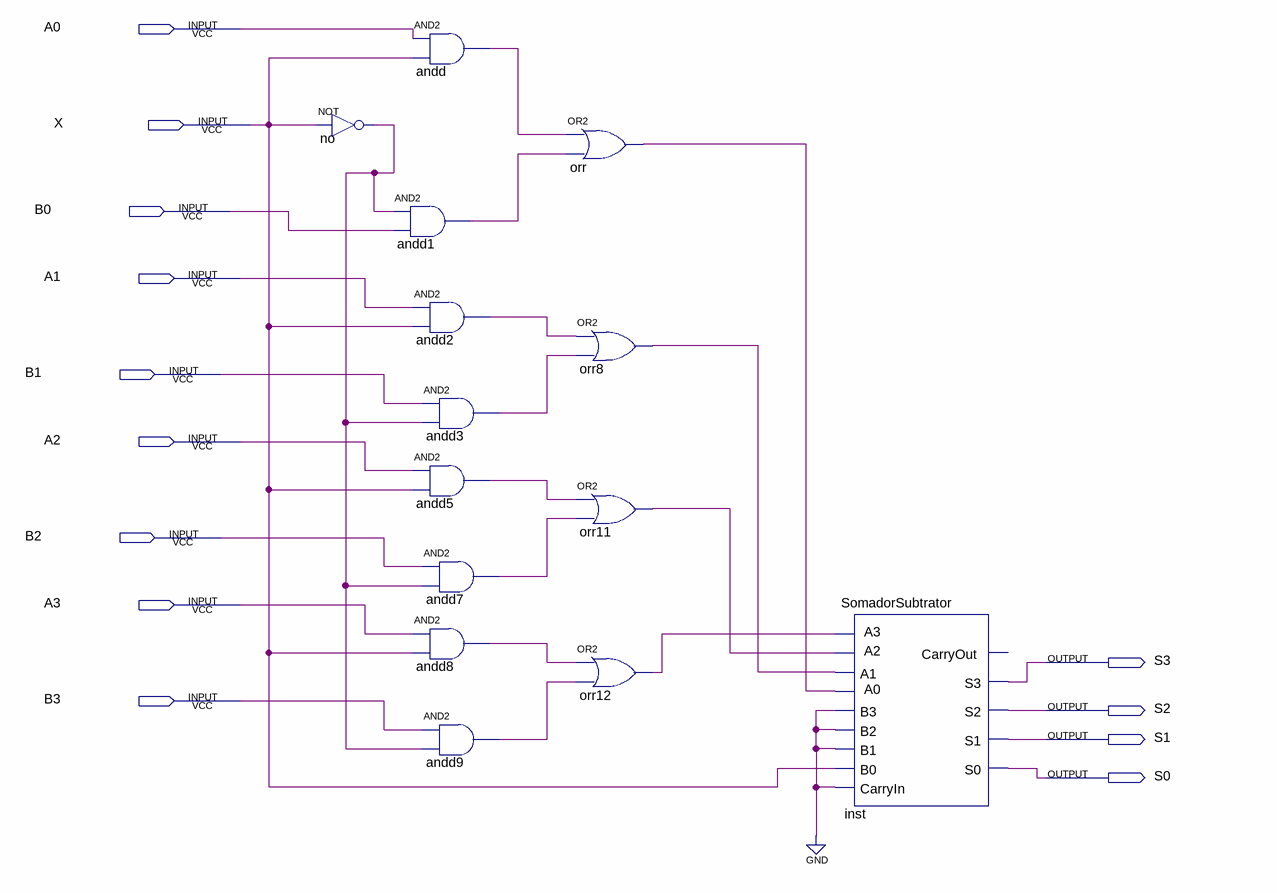
[diagram p0: schematic sheet]
// Quartus schematic TransformarNeg.bdf as structural Verilog: 14 symbols, 13 pins
module TransformarNeg (
  input  A0,
  input  X,
  input  B0,
  input  A1,
  input  B1,
  input  A2,
  input  B2,
  input  A3,
  input  B3,
  output S3,
  output S2,
  output S1,
  output S0
);

  wire andd1_out, andd2_out, andd3_out, andd5_out, andd7_out, andd8_out, andd9_out, andd_out, no_out,
       orr8_out, orr11_out, orr12_out, orr_out;

  not no (no_out, X);
  and andd (andd_out, A0, X);
  and andd1 (andd1_out, no_out, B0);
  and andd2 (andd2_out, A1, X);
  and andd3 (andd3_out, B1, no_out);
  and andd5 (andd5_out, A2, X);
  and andd7 (andd7_out, B2, no_out);
  and andd8 (andd8_out, A3, X);
  and andd9 (andd9_out, B3, no_out);
  or orr (orr_out, andd_out, andd1_out);
  or orr8 (orr8_out, andd2_out, andd3_out);
  or orr11 (orr11_out, andd5_out, andd7_out);
  or orr12 (orr12_out, andd8_out, andd9_out);
  SomadorSubtrator inst (
    .B0(X), .B1(1'b0), .B2(1'b0), .B3(1'b0), .A1(orr8_out), .A0(orr_out), .A2(orr11_out), .A3(orr12_out),
    .CarryIn(1'b0), .S1(S1), .S2(S2), .S0(S0), .S3(S3));  // open: CarryOut
endmodule
